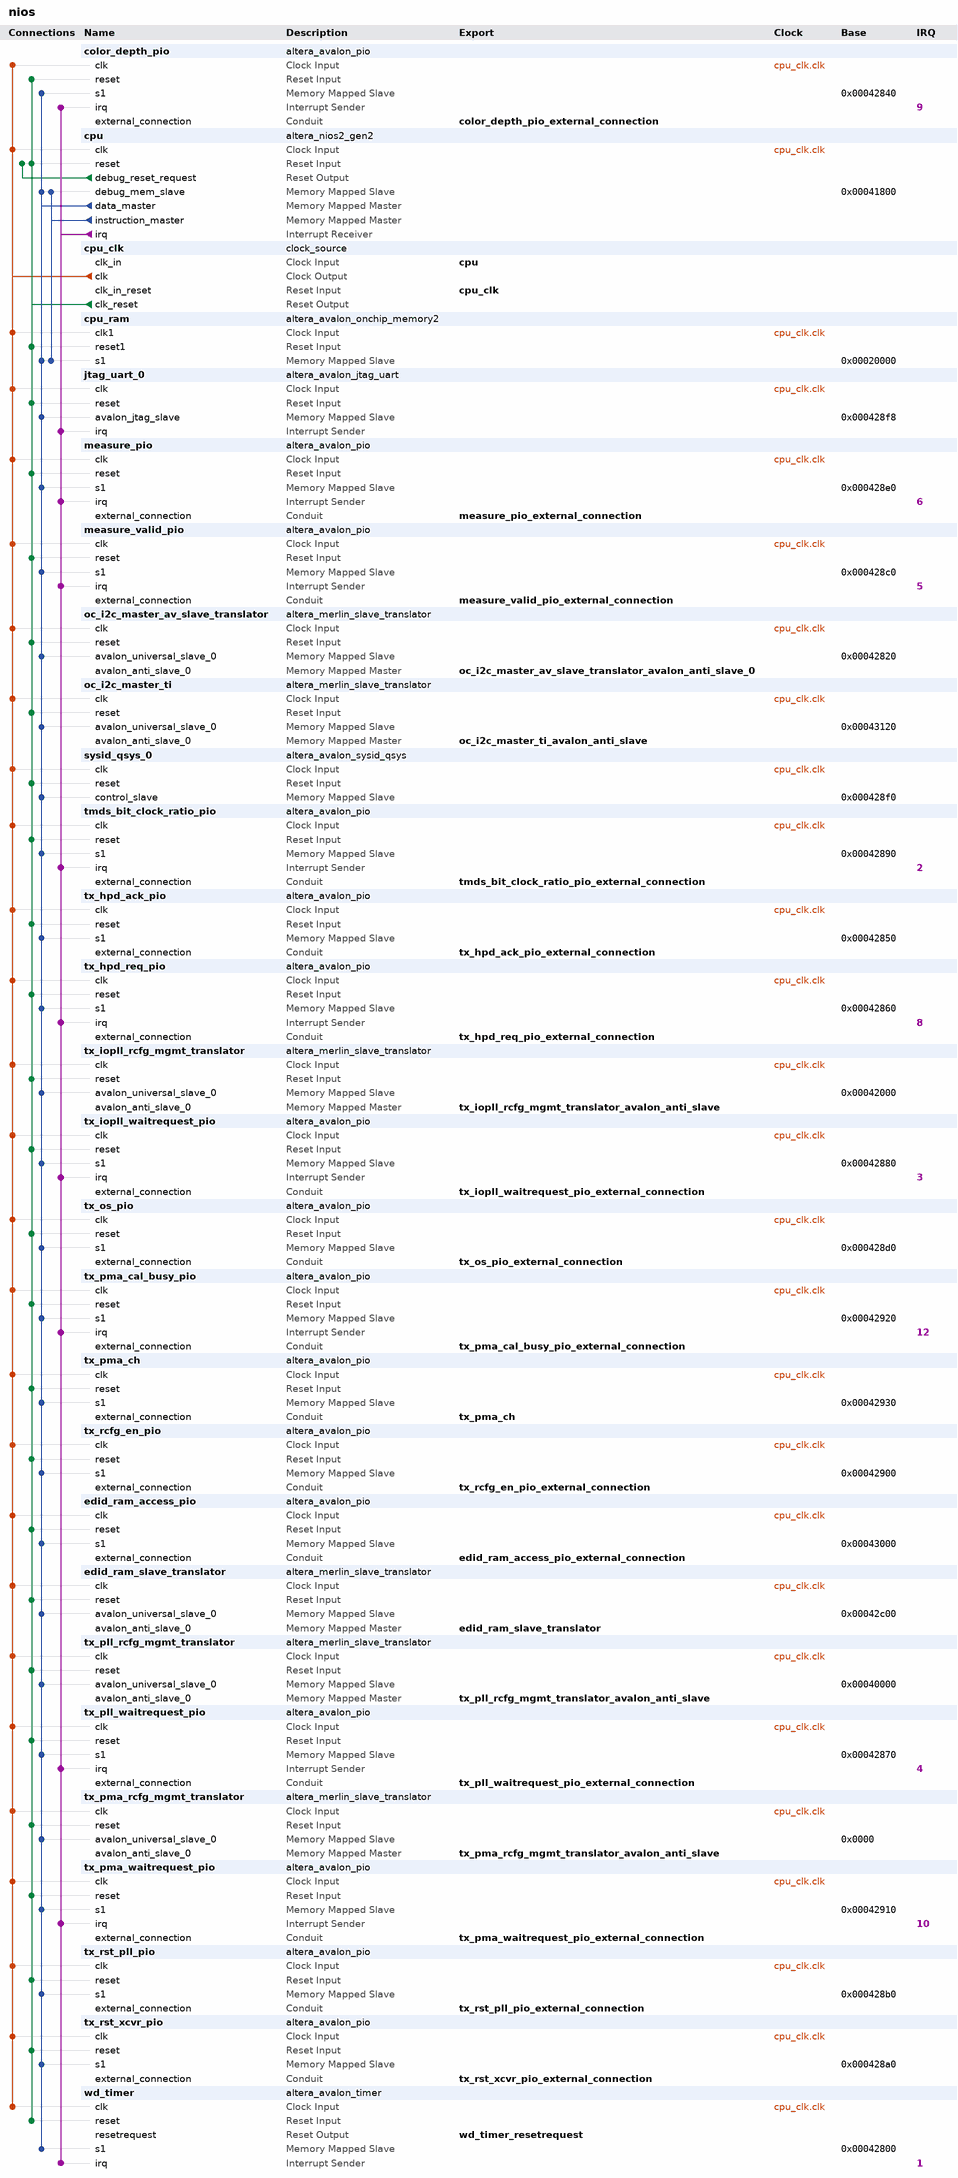
[diagram p0: system contents]
# Platform Designer (Qsys) system nios, Cyclone 10 GX 10CX220YF780E5G
# Parameters at their usual value, and those the tool derives, are not listed.
package require -exact qsys 1.0
create_system nios
set_project_property DEVICE_FAMILY {Cyclone 10 GX}
set_project_property DEVICE 10CX220YF780E5G

add_component color_depth_pio ip/nios/nios_color_depth_pio.ip altera_avalon_pio color_depth_pio 18.1
load_component color_depth_pio
set_component_parameter_value bitClearingEdgeCapReg true
set_component_parameter_value captureEdge true
set_component_parameter_value direction Input
set_component_parameter_value edgeType ANY
set_component_parameter_value generateIRQ true
set_component_parameter_value irqType EDGE
set_component_parameter_value simDoTestBenchWiring true
set_component_parameter_value width 2
save_component

add_component cpu ip/nios/nios_cpu.ip altera_nios2_gen2 cpu 18.1
load_component cpu
set_component_parameter_value setting_activateTrace true
set_component_parameter_value resetSlave cpu_ram.s1
set_component_parameter_value exceptionSlave cpu_ram.s1
set_component_parameter_value mul_32_impl 3
set_component_parameter_value shift_rot_impl 0
set_component_parameter_value impl Tiny
set_component_parameter_value icache_size 4096
set_component_parameter_value dcache_size 2048
save_component

add_component cpu_clk ip/nios/nios_cpu_clk.ip clock_source cpu_clk 
load_component cpu_clk
set_component_parameter_value clockFrequency 100000000
save_component

add_component cpu_ram ip/nios/nios_cpu_ram.ip altera_avalon_onchip_memory2 cpu_ram 18.1
load_component cpu_ram
set_component_parameter_value dataWidth 32
set_component_parameter_value dualPort false
set_component_parameter_value initMemContent true
set_component_parameter_value initializationFileName onchip_mem.hex
set_component_parameter_value memorySize 120000
save_component

add_component jtag_uart_0 ip/nios/nios_jtag_uart_0.ip altera_avalon_jtag_uart jtag_uart_0 18.1
load_component jtag_uart_0
set_component_parameter_value readBufferDepth 1024
set_component_parameter_value readIRQThreshold 1
set_component_parameter_value simInteractiveOptions NO_INTERACTIVE_WINDOWS
set_component_parameter_value writeBufferDepth 1024
set_component_parameter_value writeIRQThreshold 1
save_component

add_component measure_pio ip/nios/nios_measure_pio.ip altera_avalon_pio measure_pio 18.1
load_component measure_pio
set_component_parameter_value bitClearingEdgeCapReg true
set_component_parameter_value captureEdge true
set_component_parameter_value direction Input
set_component_parameter_value edgeType ANY
set_component_parameter_value generateIRQ true
set_component_parameter_value irqType EDGE
set_component_parameter_value simDoTestBenchWiring true
set_component_parameter_value width 24
save_component

add_component measure_valid_pio ip/nios/nios_measure_valid_pio.ip altera_avalon_pio measure_valid_pio 18.1
load_component measure_valid_pio
set_component_parameter_value bitClearingEdgeCapReg true
set_component_parameter_value captureEdge true
set_component_parameter_value direction Input
set_component_parameter_value edgeType ANY
set_component_parameter_value generateIRQ true
set_component_parameter_value irqType EDGE
set_component_parameter_value simDoTestBenchWiring true
set_component_parameter_value width 1
save_component

add_component oc_i2c_master_av_slave_translator ip/nios/nios_oc_i2c_master_av_slave_translator.ip altera_merlin_slave_translator oc_i2c_master_av_slave_translator 18.1
load_component oc_i2c_master_av_slave_translator
set_component_parameter_value AV_ADDRESS_W 3
set_component_parameter_value AV_DATA_W 32
set_component_parameter_value UAV_DATA_W 32
set_component_parameter_value AV_BURSTCOUNT_W 1
set_component_parameter_value AV_BYTEENABLE_W 4
set_component_parameter_value UAV_BYTEENABLE_W 4
set_component_parameter_value UAV_ADDRESS_W 5
set_component_parameter_value UAV_BURSTCOUNT_W 3
set_component_parameter_value AV_READLATENCY 0
set_component_parameter_value AV_SETUP_WAIT 0
set_component_parameter_value AV_WRITE_WAIT 0
set_component_parameter_value AV_READ_WAIT 1
set_component_parameter_value AV_DATA_HOLD 0
set_component_parameter_value AV_TIMING_UNITS 1
set_component_parameter_value USE_READDATA 1
set_component_parameter_value USE_WRITEDATA 1
set_component_parameter_value USE_READ 0
set_component_parameter_value USE_WRITE 1
set_component_parameter_value USE_BEGINBURSTTRANSFER 0
set_component_parameter_value USE_BEGINTRANSFER 0
set_component_parameter_value USE_BYTEENABLE 0
set_component_parameter_value USE_CHIPSELECT 1
set_component_parameter_value USE_ADDRESS 1
set_component_parameter_value USE_BURSTCOUNT 0
set_component_parameter_value USE_READDATAVALID 0
set_component_parameter_value USE_WAITREQUEST 1
set_component_parameter_value USE_WRITEBYTEENABLE 0
set_component_parameter_value USE_LOCK 0
set_component_parameter_value USE_AV_CLKEN 0
set_component_parameter_value USE_UAV_CLKEN 0
set_component_parameter_value USE_OUTPUTENABLE 0
set_component_parameter_value USE_DEBUGACCESS 0
set_component_parameter_value USE_READRESPONSE 0
set_component_parameter_value USE_WRITERESPONSE 0
set_component_parameter_value AV_SYMBOLS_PER_WORD 4
set_component_parameter_value AV_ADDRESS_SYMBOLS 0
set_component_parameter_value AV_BURSTCOUNT_SYMBOLS 0
set_component_parameter_value AV_CONSTANT_BURST_BEHAVIOR 0
set_component_parameter_value UAV_CONSTANT_BURST_BEHAVIOR 0
set_component_parameter_value AV_REQUIRE_UNALIGNED_ADDRESSES 0
set_component_parameter_value AV_LINEWRAPBURSTS 0
set_component_parameter_value AV_MAX_PENDING_READ_TRANSACTIONS 64
set_component_parameter_value AV_MAX_PENDING_WRITE_TRANSACTIONS 0
set_component_parameter_value AV_BURSTBOUNDARIES 0
set_component_parameter_value AV_INTERLEAVEBURSTS 0
set_component_parameter_value AV_BITS_PER_SYMBOL 8
set_component_parameter_value AV_ISBIGENDIAN 0
set_component_parameter_value AV_ADDRESSGROUP 0
set_component_parameter_value UAV_ADDRESSGROUP 0
set_component_parameter_value AV_REGISTEROUTGOINGSIGNALS 0
set_component_parameter_value AV_REGISTERINCOMINGSIGNALS 0
set_component_parameter_value AV_ALWAYSBURSTMAXBURST 0
set_component_parameter_value CHIPSELECT_THROUGH_READLATENCY 0
set_component_parameter_value CLOCK_RATE 100000000
set_component_parameter_value AV_READ_WAIT_CYCLES 1
set_component_parameter_value AV_WRITE_WAIT_CYCLES 0
set_component_parameter_value AV_SETUP_WAIT_CYCLES 0
set_component_parameter_value AV_DATA_HOLD_CYCLES 0
set_component_parameter_value WAITREQUEST_ALLOWANCE 0
set_component_parameter_value SYNC_RESET 0
save_component

add_component oc_i2c_master_ti ip/nios/nios_oc_i2c_master_ti.ip altera_merlin_slave_translator oc_i2c_master_ti 18.1
load_component oc_i2c_master_ti
set_component_parameter_value AV_ADDRESS_W 3
set_component_parameter_value AV_DATA_W 32
set_component_parameter_value UAV_DATA_W 32
set_component_parameter_value AV_BURSTCOUNT_W 1
set_component_parameter_value AV_BYTEENABLE_W 4
set_component_parameter_value UAV_BYTEENABLE_W 4
set_component_parameter_value UAV_ADDRESS_W 5
set_component_parameter_value UAV_BURSTCOUNT_W 3
set_component_parameter_value AV_READLATENCY 0
set_component_parameter_value AV_SETUP_WAIT 0
set_component_parameter_value AV_WRITE_WAIT 0
set_component_parameter_value AV_READ_WAIT 1
set_component_parameter_value AV_DATA_HOLD 0
set_component_parameter_value AV_TIMING_UNITS 1
set_component_parameter_value USE_READDATA 1
set_component_parameter_value USE_WRITEDATA 1
set_component_parameter_value USE_READ 0
set_component_parameter_value USE_WRITE 1
set_component_parameter_value USE_BEGINBURSTTRANSFER 0
set_component_parameter_value USE_BEGINTRANSFER 0
set_component_parameter_value USE_BYTEENABLE 0
set_component_parameter_value USE_CHIPSELECT 1
set_component_parameter_value USE_ADDRESS 1
set_component_parameter_value USE_BURSTCOUNT 0
set_component_parameter_value USE_READDATAVALID 0
set_component_parameter_value USE_WAITREQUEST 1
set_component_parameter_value USE_WRITEBYTEENABLE 0
set_component_parameter_value USE_LOCK 0
set_component_parameter_value USE_AV_CLKEN 0
set_component_parameter_value USE_UAV_CLKEN 0
set_component_parameter_value USE_OUTPUTENABLE 0
set_component_parameter_value USE_DEBUGACCESS 0
set_component_parameter_value USE_READRESPONSE 0
set_component_parameter_value USE_WRITERESPONSE 0
set_component_parameter_value AV_SYMBOLS_PER_WORD 4
set_component_parameter_value AV_ADDRESS_SYMBOLS 0
set_component_parameter_value AV_BURSTCOUNT_SYMBOLS 0
set_component_parameter_value AV_CONSTANT_BURST_BEHAVIOR 0
set_component_parameter_value UAV_CONSTANT_BURST_BEHAVIOR 0
set_component_parameter_value AV_REQUIRE_UNALIGNED_ADDRESSES 0
set_component_parameter_value AV_LINEWRAPBURSTS 0
set_component_parameter_value AV_MAX_PENDING_READ_TRANSACTIONS 64
set_component_parameter_value AV_MAX_PENDING_WRITE_TRANSACTIONS 0
set_component_parameter_value AV_BURSTBOUNDARIES 0
set_component_parameter_value AV_INTERLEAVEBURSTS 0
set_component_parameter_value AV_BITS_PER_SYMBOL 8
set_component_parameter_value AV_ISBIGENDIAN 0
set_component_parameter_value AV_ADDRESSGROUP 0
set_component_parameter_value UAV_ADDRESSGROUP 0
set_component_parameter_value AV_REGISTEROUTGOINGSIGNALS 0
set_component_parameter_value AV_REGISTERINCOMINGSIGNALS 0
set_component_parameter_value AV_ALWAYSBURSTMAXBURST 0
set_component_parameter_value CHIPSELECT_THROUGH_READLATENCY 0
set_component_parameter_value CLOCK_RATE 100000000
set_component_parameter_value AV_READ_WAIT_CYCLES 1
set_component_parameter_value AV_WRITE_WAIT_CYCLES 0
set_component_parameter_value AV_SETUP_WAIT_CYCLES 0
set_component_parameter_value AV_DATA_HOLD_CYCLES 0
set_component_parameter_value WAITREQUEST_ALLOWANCE 0
set_component_parameter_value SYNC_RESET 0
save_component

add_component sysid_qsys_0 ip/nios/nios_sysid_qsys_0.ip altera_avalon_sysid_qsys sysid_qsys_0 18.1
load_component sysid_qsys_0
set_component_parameter_value id 0
set_component_parameter_value ID_VALUE 0
set_component_parameter_value TIMESTAMP 0
save_component

add_component tmds_bit_clock_ratio_pio ip/nios/nios_tmds_bit_clock_ratio_pio.ip altera_avalon_pio tmds_bit_clock_ratio_pio 18.1
load_component tmds_bit_clock_ratio_pio
set_component_parameter_value bitClearingEdgeCapReg true
set_component_parameter_value captureEdge true
set_component_parameter_value direction Input
set_component_parameter_value edgeType ANY
set_component_parameter_value generateIRQ true
set_component_parameter_value irqType EDGE
set_component_parameter_value width 1
save_component

add_component tx_hpd_ack_pio ip/nios/nios_tx_hpd_ack_pio.ip altera_avalon_pio tx_hpd_ack_pio 18.1
load_component tx_hpd_ack_pio
set_component_parameter_value direction Output
set_component_parameter_value width 1
save_component

add_component tx_hpd_req_pio ip/nios/nios_tx_hpd_req_pio.ip altera_avalon_pio tx_hpd_req_pio 18.1
load_component tx_hpd_req_pio
set_component_parameter_value bitClearingEdgeCapReg true
set_component_parameter_value captureEdge true
set_component_parameter_value direction Input
set_component_parameter_value edgeType ANY
set_component_parameter_value generateIRQ true
set_component_parameter_value irqType EDGE
set_component_parameter_value simDoTestBenchWiring true
set_component_parameter_value width 1
save_component

add_component tx_iopll_rcfg_mgmt_translator ip/nios/nios_tx_iopll_rcfg_mgmt_translator.ip altera_merlin_slave_translator tx_iopll_rcfg_mgmt_translator 18.1
load_component tx_iopll_rcfg_mgmt_translator
set_component_parameter_value AV_ADDRESS_W 9
set_component_parameter_value AV_DATA_W 32
set_component_parameter_value UAV_DATA_W 32
set_component_parameter_value AV_BURSTCOUNT_W 1
set_component_parameter_value AV_BYTEENABLE_W 4
set_component_parameter_value UAV_BYTEENABLE_W 4
set_component_parameter_value UAV_ADDRESS_W 12
set_component_parameter_value UAV_BURSTCOUNT_W 3
set_component_parameter_value AV_READLATENCY 0
set_component_parameter_value AV_SETUP_WAIT 0
set_component_parameter_value AV_WRITE_WAIT 0
set_component_parameter_value AV_READ_WAIT 1
set_component_parameter_value AV_DATA_HOLD 0
set_component_parameter_value AV_TIMING_UNITS 1
set_component_parameter_value USE_READDATA 1
set_component_parameter_value USE_WRITEDATA 1
set_component_parameter_value USE_READ 1
set_component_parameter_value USE_WRITE 1
set_component_parameter_value USE_BEGINBURSTTRANSFER 0
set_component_parameter_value USE_BEGINTRANSFER 0
set_component_parameter_value USE_BYTEENABLE 0
set_component_parameter_value USE_CHIPSELECT 0
set_component_parameter_value USE_ADDRESS 1
set_component_parameter_value USE_BURSTCOUNT 0
set_component_parameter_value USE_READDATAVALID 0
set_component_parameter_value USE_WAITREQUEST 0
set_component_parameter_value USE_WRITEBYTEENABLE 0
set_component_parameter_value USE_LOCK 0
set_component_parameter_value USE_AV_CLKEN 0
set_component_parameter_value USE_UAV_CLKEN 0
set_component_parameter_value USE_OUTPUTENABLE 0
set_component_parameter_value USE_DEBUGACCESS 0
set_component_parameter_value USE_READRESPONSE 0
set_component_parameter_value USE_WRITERESPONSE 0
set_component_parameter_value AV_SYMBOLS_PER_WORD 4
set_component_parameter_value AV_ADDRESS_SYMBOLS 0
set_component_parameter_value AV_BURSTCOUNT_SYMBOLS 0
set_component_parameter_value AV_CONSTANT_BURST_BEHAVIOR 0
set_component_parameter_value UAV_CONSTANT_BURST_BEHAVIOR 0
set_component_parameter_value AV_REQUIRE_UNALIGNED_ADDRESSES 0
set_component_parameter_value AV_LINEWRAPBURSTS 0
set_component_parameter_value AV_MAX_PENDING_READ_TRANSACTIONS 64
set_component_parameter_value AV_MAX_PENDING_WRITE_TRANSACTIONS 0
set_component_parameter_value AV_BURSTBOUNDARIES 0
set_component_parameter_value AV_INTERLEAVEBURSTS 0
set_component_parameter_value AV_BITS_PER_SYMBOL 8
set_component_parameter_value AV_ISBIGENDIAN 0
set_component_parameter_value AV_ADDRESSGROUP 0
set_component_parameter_value UAV_ADDRESSGROUP 0
set_component_parameter_value AV_REGISTEROUTGOINGSIGNALS 0
set_component_parameter_value AV_REGISTERINCOMINGSIGNALS 0
set_component_parameter_value AV_ALWAYSBURSTMAXBURST 0
set_component_parameter_value CHIPSELECT_THROUGH_READLATENCY 0
set_component_parameter_value CLOCK_RATE 100000000
set_component_parameter_value AV_READ_WAIT_CYCLES 1
set_component_parameter_value AV_WRITE_WAIT_CYCLES 0
set_component_parameter_value AV_SETUP_WAIT_CYCLES 0
set_component_parameter_value AV_DATA_HOLD_CYCLES 0
set_component_parameter_value WAITREQUEST_ALLOWANCE 0
set_component_parameter_value SYNC_RESET 0
save_component

add_component tx_iopll_waitrequest_pio ip/nios/nios_tx_iopll_waitrequest_pio.ip altera_avalon_pio tx_iopll_waitrequest_pio 18.1
load_component tx_iopll_waitrequest_pio
set_component_parameter_value bitClearingEdgeCapReg true
set_component_parameter_value captureEdge true
set_component_parameter_value direction Input
set_component_parameter_value edgeType ANY
set_component_parameter_value generateIRQ true
set_component_parameter_value irqType EDGE
set_component_parameter_value simDoTestBenchWiring true
set_component_parameter_value width 1
save_component

add_component tx_os_pio ip/nios/nios_tx_os_pio.ip altera_avalon_pio tx_os_pio 18.1
load_component tx_os_pio
set_component_parameter_value direction Output
set_component_parameter_value width 2
save_component

add_component tx_pma_cal_busy_pio ip/nios/nios_tx_pma_cal_busy_pio.ip altera_avalon_pio tx_pma_cal_busy_pio 18.1
load_component tx_pma_cal_busy_pio
set_component_parameter_value bitClearingEdgeCapReg true
set_component_parameter_value captureEdge true
set_component_parameter_value direction Input
set_component_parameter_value edgeType ANY
set_component_parameter_value generateIRQ true
set_component_parameter_value irqType EDGE
set_component_parameter_value simDoTestBenchWiring true
set_component_parameter_value width 1
save_component

add_component tx_pma_ch ip/nios/nios_tx_pma_ch.ip altera_avalon_pio tx_pma_ch 18.1
load_component tx_pma_ch
set_component_parameter_value direction Output
set_component_parameter_value width 2
save_component

add_component tx_rcfg_en_pio ip/nios/nios_tx_rcfg_en_pio.ip altera_avalon_pio tx_rcfg_en_pio 18.1
load_component tx_rcfg_en_pio
set_component_parameter_value direction Output
set_component_parameter_value width 1
save_component

add_component edid_ram_access_pio ip/nios/nios_edid_ram_access_pio.ip altera_avalon_pio edid_ram_access_pio 18.1
load_component edid_ram_access_pio
set_component_parameter_value direction Output
set_component_parameter_value width 1
save_component

add_component edid_ram_slave_translator ip/nios/nios_edid_ram_slave_translator.ip altera_merlin_slave_translator edid_ram_slave_translator 18.1
load_component edid_ram_slave_translator
set_component_parameter_value AV_ADDRESS_W 8
set_component_parameter_value AV_DATA_W 8
set_component_parameter_value UAV_DATA_W 8
set_component_parameter_value AV_BURSTCOUNT_W 1
set_component_parameter_value AV_BYTEENABLE_W 1
set_component_parameter_value UAV_BYTEENABLE_W 1
set_component_parameter_value UAV_ADDRESS_W 11
set_component_parameter_value UAV_BURSTCOUNT_W 3
set_component_parameter_value AV_READLATENCY 0
set_component_parameter_value AV_SETUP_WAIT 0
set_component_parameter_value AV_WRITE_WAIT 1
set_component_parameter_value AV_READ_WAIT 0
set_component_parameter_value AV_DATA_HOLD 0
set_component_parameter_value AV_TIMING_UNITS 1
set_component_parameter_value USE_READDATA 1
set_component_parameter_value USE_WRITEDATA 1
set_component_parameter_value USE_READ 1
set_component_parameter_value USE_WRITE 1
set_component_parameter_value USE_BEGINBURSTTRANSFER 0
set_component_parameter_value USE_BEGINTRANSFER 0
set_component_parameter_value USE_BYTEENABLE 0
set_component_parameter_value USE_CHIPSELECT 0
set_component_parameter_value USE_ADDRESS 1
set_component_parameter_value USE_BURSTCOUNT 0
set_component_parameter_value USE_READDATAVALID 0
set_component_parameter_value USE_WAITREQUEST 1
set_component_parameter_value USE_WRITEBYTEENABLE 0
set_component_parameter_value USE_LOCK 0
set_component_parameter_value USE_AV_CLKEN 0
set_component_parameter_value USE_UAV_CLKEN 0
set_component_parameter_value USE_OUTPUTENABLE 0
set_component_parameter_value USE_DEBUGACCESS 0
set_component_parameter_value USE_READRESPONSE 0
set_component_parameter_value USE_WRITERESPONSE 0
set_component_parameter_value AV_SYMBOLS_PER_WORD 4
set_component_parameter_value AV_ADDRESS_SYMBOLS 0
set_component_parameter_value AV_BURSTCOUNT_SYMBOLS 0
set_component_parameter_value AV_CONSTANT_BURST_BEHAVIOR 0
set_component_parameter_value UAV_CONSTANT_BURST_BEHAVIOR 0
set_component_parameter_value AV_REQUIRE_UNALIGNED_ADDRESSES 0
set_component_parameter_value AV_LINEWRAPBURSTS 0
set_component_parameter_value AV_MAX_PENDING_READ_TRANSACTIONS 64
set_component_parameter_value AV_MAX_PENDING_WRITE_TRANSACTIONS 0
set_component_parameter_value AV_BURSTBOUNDARIES 0
set_component_parameter_value AV_INTERLEAVEBURSTS 0
set_component_parameter_value AV_BITS_PER_SYMBOL 8
set_component_parameter_value AV_ISBIGENDIAN 0
set_component_parameter_value AV_ADDRESSGROUP 0
set_component_parameter_value UAV_ADDRESSGROUP 0
set_component_parameter_value AV_REGISTEROUTGOINGSIGNALS 0
set_component_parameter_value AV_REGISTERINCOMINGSIGNALS 0
set_component_parameter_value AV_ALWAYSBURSTMAXBURST 0
set_component_parameter_value CHIPSELECT_THROUGH_READLATENCY 0
set_component_parameter_value CLOCK_RATE 100000000
set_component_parameter_value AV_READ_WAIT_CYCLES 0
set_component_parameter_value AV_WRITE_WAIT_CYCLES 1
set_component_parameter_value AV_SETUP_WAIT_CYCLES 0
set_component_parameter_value AV_DATA_HOLD_CYCLES 0
set_component_parameter_value WAITREQUEST_ALLOWANCE 0
set_component_parameter_value SYNC_RESET 0
save_component

add_component tx_pll_rcfg_mgmt_translator ip/nios/nios_tx_pll_rcfg_mgmt_translator.ip altera_merlin_slave_translator tx_pll_rcfg_mgmt_translator 18.1
load_component tx_pll_rcfg_mgmt_translator
set_component_parameter_value AV_ADDRESS_W 10
set_component_parameter_value AV_DATA_W 32
set_component_parameter_value UAV_DATA_W 32
set_component_parameter_value AV_BURSTCOUNT_W 1
set_component_parameter_value AV_BYTEENABLE_W 4
set_component_parameter_value UAV_BYTEENABLE_W 4
set_component_parameter_value UAV_ADDRESS_W 12
set_component_parameter_value UAV_BURSTCOUNT_W 3
set_component_parameter_value AV_READLATENCY 0
set_component_parameter_value AV_SETUP_WAIT 0
set_component_parameter_value AV_WRITE_WAIT 0
set_component_parameter_value AV_READ_WAIT 1
set_component_parameter_value AV_DATA_HOLD 0
set_component_parameter_value AV_TIMING_UNITS 1
set_component_parameter_value USE_READDATA 1
set_component_parameter_value USE_WRITEDATA 1
set_component_parameter_value USE_READ 1
set_component_parameter_value USE_WRITE 1
set_component_parameter_value USE_BEGINBURSTTRANSFER 0
set_component_parameter_value USE_BEGINTRANSFER 0
set_component_parameter_value USE_BYTEENABLE 0
set_component_parameter_value USE_CHIPSELECT 0
set_component_parameter_value USE_ADDRESS 1
set_component_parameter_value USE_BURSTCOUNT 0
set_component_parameter_value USE_READDATAVALID 0
set_component_parameter_value USE_WAITREQUEST 1
set_component_parameter_value USE_WRITEBYTEENABLE 0
set_component_parameter_value USE_LOCK 0
set_component_parameter_value USE_AV_CLKEN 0
set_component_parameter_value USE_UAV_CLKEN 0
set_component_parameter_value USE_OUTPUTENABLE 0
set_component_parameter_value USE_DEBUGACCESS 0
set_component_parameter_value USE_READRESPONSE 0
set_component_parameter_value USE_WRITERESPONSE 0
set_component_parameter_value AV_SYMBOLS_PER_WORD 4
set_component_parameter_value AV_ADDRESS_SYMBOLS 0
set_component_parameter_value AV_BURSTCOUNT_SYMBOLS 0
set_component_parameter_value AV_CONSTANT_BURST_BEHAVIOR 0
set_component_parameter_value UAV_CONSTANT_BURST_BEHAVIOR 0
set_component_parameter_value AV_REQUIRE_UNALIGNED_ADDRESSES 0
set_component_parameter_value AV_LINEWRAPBURSTS 0
set_component_parameter_value AV_MAX_PENDING_READ_TRANSACTIONS 64
set_component_parameter_value AV_MAX_PENDING_WRITE_TRANSACTIONS 0
set_component_parameter_value AV_BURSTBOUNDARIES 0
set_component_parameter_value AV_INTERLEAVEBURSTS 0
set_component_parameter_value AV_BITS_PER_SYMBOL 8
set_component_parameter_value AV_ISBIGENDIAN 0
set_component_parameter_value AV_ADDRESSGROUP 0
set_component_parameter_value UAV_ADDRESSGROUP 0
set_component_parameter_value AV_REGISTEROUTGOINGSIGNALS 0
set_component_parameter_value AV_REGISTERINCOMINGSIGNALS 0
set_component_parameter_value AV_ALWAYSBURSTMAXBURST 0
set_component_parameter_value CHIPSELECT_THROUGH_READLATENCY 0
set_component_parameter_value CLOCK_RATE 100000000
set_component_parameter_value AV_READ_WAIT_CYCLES 1
set_component_parameter_value AV_WRITE_WAIT_CYCLES 0
set_component_parameter_value AV_SETUP_WAIT_CYCLES 0
set_component_parameter_value AV_DATA_HOLD_CYCLES 0
set_component_parameter_value WAITREQUEST_ALLOWANCE 0
set_component_parameter_value SYNC_RESET 0
save_component

add_component tx_pll_waitrequest_pio ip/nios/nios_tx_pll_waitrequest_pio.ip altera_avalon_pio tx_pll_waitrequest_pio 18.1
load_component tx_pll_waitrequest_pio
set_component_parameter_value bitClearingEdgeCapReg true
set_component_parameter_value captureEdge true
set_component_parameter_value direction Input
set_component_parameter_value edgeType ANY
set_component_parameter_value generateIRQ true
set_component_parameter_value irqType EDGE
set_component_parameter_value simDoTestBenchWiring true
set_component_parameter_value width 1
save_component

add_component tx_pma_rcfg_mgmt_translator ip/nios/nios_tx_pma_rcfg_mgmt_translator.ip altera_merlin_slave_translator tx_pma_rcfg_mgmt_translator 18.1
load_component tx_pma_rcfg_mgmt_translator
set_component_parameter_value AV_ADDRESS_W 12
set_component_parameter_value AV_DATA_W 32
set_component_parameter_value UAV_DATA_W 32
set_component_parameter_value AV_BURSTCOUNT_W 1
set_component_parameter_value AV_BYTEENABLE_W 4
set_component_parameter_value UAV_BYTEENABLE_W 4
set_component_parameter_value UAV_ADDRESS_W 14
set_component_parameter_value UAV_BURSTCOUNT_W 3
set_component_parameter_value AV_READLATENCY 0
set_component_parameter_value AV_SETUP_WAIT 0
set_component_parameter_value AV_WRITE_WAIT 0
set_component_parameter_value AV_READ_WAIT 1
set_component_parameter_value AV_DATA_HOLD 0
set_component_parameter_value AV_TIMING_UNITS 1
set_component_parameter_value USE_READDATA 1
set_component_parameter_value USE_WRITEDATA 1
set_component_parameter_value USE_READ 1
set_component_parameter_value USE_WRITE 1
set_component_parameter_value USE_BEGINBURSTTRANSFER 0
set_component_parameter_value USE_BEGINTRANSFER 0
set_component_parameter_value USE_BYTEENABLE 0
set_component_parameter_value USE_CHIPSELECT 0
set_component_parameter_value USE_ADDRESS 1
set_component_parameter_value USE_BURSTCOUNT 0
set_component_parameter_value USE_READDATAVALID 0
set_component_parameter_value USE_WAITREQUEST 1
set_component_parameter_value USE_WRITEBYTEENABLE 0
set_component_parameter_value USE_LOCK 0
set_component_parameter_value USE_AV_CLKEN 0
set_component_parameter_value USE_UAV_CLKEN 0
set_component_parameter_value USE_OUTPUTENABLE 0
set_component_parameter_value USE_DEBUGACCESS 0
set_component_parameter_value USE_READRESPONSE 0
set_component_parameter_value USE_WRITERESPONSE 0
set_component_parameter_value AV_SYMBOLS_PER_WORD 4
set_component_parameter_value AV_ADDRESS_SYMBOLS 0
set_component_parameter_value AV_BURSTCOUNT_SYMBOLS 0
set_component_parameter_value AV_CONSTANT_BURST_BEHAVIOR 0
set_component_parameter_value UAV_CONSTANT_BURST_BEHAVIOR 0
set_component_parameter_value AV_REQUIRE_UNALIGNED_ADDRESSES 0
set_component_parameter_value AV_LINEWRAPBURSTS 0
set_component_parameter_value AV_MAX_PENDING_READ_TRANSACTIONS 64
set_component_parameter_value AV_MAX_PENDING_WRITE_TRANSACTIONS 0
set_component_parameter_value AV_BURSTBOUNDARIES 0
set_component_parameter_value AV_INTERLEAVEBURSTS 0
set_component_parameter_value AV_BITS_PER_SYMBOL 8
set_component_parameter_value AV_ISBIGENDIAN 0
set_component_parameter_value AV_ADDRESSGROUP 0
set_component_parameter_value UAV_ADDRESSGROUP 0
set_component_parameter_value AV_REGISTEROUTGOINGSIGNALS 0
set_component_parameter_value AV_REGISTERINCOMINGSIGNALS 0
set_component_parameter_value AV_ALWAYSBURSTMAXBURST 0
set_component_parameter_value CHIPSELECT_THROUGH_READLATENCY 0
set_component_parameter_value CLOCK_RATE 100000000
set_component_parameter_value AV_READ_WAIT_CYCLES 1
set_component_parameter_value AV_WRITE_WAIT_CYCLES 0
set_component_parameter_value AV_SETUP_WAIT_CYCLES 0
set_component_parameter_value AV_DATA_HOLD_CYCLES 0
set_component_parameter_value WAITREQUEST_ALLOWANCE 0
set_component_parameter_value SYNC_RESET 0
save_component

add_component tx_pma_waitrequest_pio ip/nios/nios_tx_pma_waitrequest_pio.ip altera_avalon_pio tx_pma_waitrequest_pio 18.1
load_component tx_pma_waitrequest_pio
set_component_parameter_value bitClearingEdgeCapReg true
set_component_parameter_value captureEdge true
set_component_parameter_value direction Input
set_component_parameter_value edgeType ANY
set_component_parameter_value generateIRQ true
set_component_parameter_value irqType EDGE
set_component_parameter_value simDoTestBenchWiring true
set_component_parameter_value width 1
save_component

add_component tx_rst_pll_pio ip/nios/nios_tx_rst_pll_pio.ip altera_avalon_pio tx_rst_pll_pio 18.1
load_component tx_rst_pll_pio
set_component_parameter_value direction Output
set_component_parameter_value width 1
save_component

add_component tx_rst_xcvr_pio ip/nios/nios_tx_rst_xcvr_pio.ip altera_avalon_pio tx_rst_xcvr_pio 18.1
load_component tx_rst_xcvr_pio
set_component_parameter_value direction Output
set_component_parameter_value width 1
save_component

add_component wd_timer ip/nios/nios_wd_timer.ip altera_avalon_timer wd_timer 18.1
load_component wd_timer
set_component_parameter_value fixedPeriod true
set_component_parameter_value period 600
set_component_parameter_value periodUnits MSEC
set_component_parameter_value resetOutput true
set_component_parameter_value snapshot false
set_component_parameter_value timerPreset CUSTOM
save_component

# connections
add_connection cpu_clk.clk color_depth_pio.clk clock
add_connection cpu_clk.clk cpu.clk clock
add_connection cpu_clk.clk cpu_ram.clk1 clock
add_connection cpu_clk.clk edid_ram_access_pio.clk clock
add_connection cpu_clk.clk edid_ram_slave_translator.clk clock
add_connection cpu_clk.clk jtag_uart_0.clk clock
add_connection cpu_clk.clk measure_pio.clk clock
add_connection cpu_clk.clk measure_valid_pio.clk clock
add_connection cpu_clk.clk oc_i2c_master_av_slave_translator.clk clock
add_connection cpu_clk.clk oc_i2c_master_ti.clk clock
add_connection cpu_clk.clk sysid_qsys_0.clk clock
add_connection cpu_clk.clk tmds_bit_clock_ratio_pio.clk clock
add_connection cpu_clk.clk tx_hpd_ack_pio.clk clock
add_connection cpu_clk.clk tx_hpd_req_pio.clk clock
add_connection cpu_clk.clk tx_iopll_rcfg_mgmt_translator.clk clock
add_connection cpu_clk.clk tx_iopll_waitrequest_pio.clk clock
add_connection cpu_clk.clk tx_os_pio.clk clock
add_connection cpu_clk.clk tx_pll_rcfg_mgmt_translator.clk clock
add_connection cpu_clk.clk tx_pll_waitrequest_pio.clk clock
add_connection cpu_clk.clk tx_pma_cal_busy_pio.clk clock
add_connection cpu_clk.clk tx_pma_ch.clk clock
add_connection cpu_clk.clk tx_pma_rcfg_mgmt_translator.clk clock
add_connection cpu_clk.clk tx_pma_waitrequest_pio.clk clock
add_connection cpu_clk.clk tx_rcfg_en_pio.clk clock
add_connection cpu_clk.clk tx_rst_pll_pio.clk clock
add_connection cpu_clk.clk tx_rst_xcvr_pio.clk clock
add_connection cpu_clk.clk wd_timer.clk clock
add_connection cpu.debug_reset_request cpu.reset reset
add_connection cpu_clk.clk_reset color_depth_pio.reset reset
add_connection cpu_clk.clk_reset cpu.reset reset
add_connection cpu_clk.clk_reset cpu_ram.reset1 reset
add_connection cpu_clk.clk_reset edid_ram_access_pio.reset reset
add_connection cpu_clk.clk_reset edid_ram_slave_translator.reset reset
add_connection cpu_clk.clk_reset jtag_uart_0.reset reset
add_connection cpu_clk.clk_reset measure_pio.reset reset
add_connection cpu_clk.clk_reset measure_valid_pio.reset reset
add_connection cpu_clk.clk_reset oc_i2c_master_av_slave_translator.reset reset
add_connection cpu_clk.clk_reset oc_i2c_master_ti.reset reset
add_connection cpu_clk.clk_reset sysid_qsys_0.reset reset
add_connection cpu_clk.clk_reset tmds_bit_clock_ratio_pio.reset reset
add_connection cpu_clk.clk_reset tx_hpd_ack_pio.reset reset
add_connection cpu_clk.clk_reset tx_hpd_req_pio.reset reset
add_connection cpu_clk.clk_reset tx_iopll_rcfg_mgmt_translator.reset reset
add_connection cpu_clk.clk_reset tx_iopll_waitrequest_pio.reset reset
add_connection cpu_clk.clk_reset tx_os_pio.reset reset
add_connection cpu_clk.clk_reset tx_pll_rcfg_mgmt_translator.reset reset
add_connection cpu_clk.clk_reset tx_pll_waitrequest_pio.reset reset
add_connection cpu_clk.clk_reset tx_pma_cal_busy_pio.reset reset
add_connection cpu_clk.clk_reset tx_pma_ch.reset reset
add_connection cpu_clk.clk_reset tx_pma_rcfg_mgmt_translator.reset reset
add_connection cpu_clk.clk_reset tx_pma_waitrequest_pio.reset reset
add_connection cpu_clk.clk_reset tx_rcfg_en_pio.reset reset
add_connection cpu_clk.clk_reset tx_rst_pll_pio.reset reset
add_connection cpu_clk.clk_reset tx_rst_xcvr_pio.reset reset
add_connection cpu_clk.clk_reset wd_timer.reset reset
add_connection cpu.data_master color_depth_pio.s1 avalon
set_connection_parameter_value cpu.data_master/color_depth_pio.s1 baseAddress 0x00042840
add_connection cpu.data_master cpu.debug_mem_slave avalon
set_connection_parameter_value cpu.data_master/cpu.debug_mem_slave baseAddress 0x00041800
add_connection cpu.data_master cpu_ram.s1 avalon
set_connection_parameter_value cpu.data_master/cpu_ram.s1 baseAddress 0x00020000
add_connection cpu.data_master edid_ram_access_pio.s1 avalon
set_connection_parameter_value cpu.data_master/edid_ram_access_pio.s1 baseAddress 0x00043000
add_connection cpu.data_master edid_ram_slave_translator.avalon_universal_slave_0 avalon
set_connection_parameter_value cpu.data_master/edid_ram_slave_translator.avalon_universal_slave_0 baseAddress 0x00042c00
add_connection cpu.data_master jtag_uart_0.avalon_jtag_slave avalon
set_connection_parameter_value cpu.data_master/jtag_uart_0.avalon_jtag_slave baseAddress 0x000428f8
add_connection cpu.data_master measure_pio.s1 avalon
set_connection_parameter_value cpu.data_master/measure_pio.s1 baseAddress 0x000428e0
add_connection cpu.data_master measure_valid_pio.s1 avalon
set_connection_parameter_value cpu.data_master/measure_valid_pio.s1 baseAddress 0x000428c0
add_connection cpu.data_master oc_i2c_master_av_slave_translator.avalon_universal_slave_0 avalon
set_connection_parameter_value cpu.data_master/oc_i2c_master_av_slave_translator.avalon_universal_slave_0 baseAddress 0x00042820
add_connection cpu.data_master oc_i2c_master_ti.avalon_universal_slave_0 avalon
set_connection_parameter_value cpu.data_master/oc_i2c_master_ti.avalon_universal_slave_0 baseAddress 0x00043120
add_connection cpu.data_master sysid_qsys_0.control_slave avalon
set_connection_parameter_value cpu.data_master/sysid_qsys_0.control_slave baseAddress 0x000428f0
add_connection cpu.data_master tmds_bit_clock_ratio_pio.s1 avalon
set_connection_parameter_value cpu.data_master/tmds_bit_clock_ratio_pio.s1 baseAddress 0x00042890
add_connection cpu.data_master tx_hpd_ack_pio.s1 avalon
set_connection_parameter_value cpu.data_master/tx_hpd_ack_pio.s1 baseAddress 0x00042850
add_connection cpu.data_master tx_hpd_req_pio.s1 avalon
set_connection_parameter_value cpu.data_master/tx_hpd_req_pio.s1 baseAddress 0x00042860
add_connection cpu.data_master tx_iopll_rcfg_mgmt_translator.avalon_universal_slave_0 avalon
set_connection_parameter_value cpu.data_master/tx_iopll_rcfg_mgmt_translator.avalon_universal_slave_0 baseAddress 0x00042000
add_connection cpu.data_master tx_iopll_waitrequest_pio.s1 avalon
set_connection_parameter_value cpu.data_master/tx_iopll_waitrequest_pio.s1 baseAddress 0x00042880
add_connection cpu.data_master tx_os_pio.s1 avalon
set_connection_parameter_value cpu.data_master/tx_os_pio.s1 baseAddress 0x000428d0
add_connection cpu.data_master tx_pll_rcfg_mgmt_translator.avalon_universal_slave_0 avalon
set_connection_parameter_value cpu.data_master/tx_pll_rcfg_mgmt_translator.avalon_universal_slave_0 baseAddress 0x00040000
add_connection cpu.data_master tx_pll_waitrequest_pio.s1 avalon
set_connection_parameter_value cpu.data_master/tx_pll_waitrequest_pio.s1 baseAddress 0x00042870
add_connection cpu.data_master tx_pma_cal_busy_pio.s1 avalon
set_connection_parameter_value cpu.data_master/tx_pma_cal_busy_pio.s1 baseAddress 0x00042920
add_connection cpu.data_master tx_pma_ch.s1 avalon
set_connection_parameter_value cpu.data_master/tx_pma_ch.s1 baseAddress 0x00042930
add_connection cpu.data_master tx_pma_rcfg_mgmt_translator.avalon_universal_slave_0 avalon
set_connection_parameter_value cpu.data_master/tx_pma_rcfg_mgmt_translator.avalon_universal_slave_0 baseAddress 0x0000
add_connection cpu.data_master tx_pma_waitrequest_pio.s1 avalon
set_connection_parameter_value cpu.data_master/tx_pma_waitrequest_pio.s1 baseAddress 0x00042910
add_connection cpu.data_master tx_rcfg_en_pio.s1 avalon
set_connection_parameter_value cpu.data_master/tx_rcfg_en_pio.s1 baseAddress 0x00042900
add_connection cpu.data_master tx_rst_pll_pio.s1 avalon
set_connection_parameter_value cpu.data_master/tx_rst_pll_pio.s1 baseAddress 0x000428b0
add_connection cpu.data_master tx_rst_xcvr_pio.s1 avalon
set_connection_parameter_value cpu.data_master/tx_rst_xcvr_pio.s1 baseAddress 0x000428a0
add_connection cpu.data_master wd_timer.s1 avalon
set_connection_parameter_value cpu.data_master/wd_timer.s1 baseAddress 0x00042800
add_connection cpu.instruction_master cpu.debug_mem_slave avalon
set_connection_parameter_value cpu.instruction_master/cpu.debug_mem_slave baseAddress 0x00041800
add_connection cpu.instruction_master cpu_ram.s1 avalon
set_connection_parameter_value cpu.instruction_master/cpu_ram.s1 baseAddress 0x00020000
add_connection cpu.irq color_depth_pio.irq interrupt
set_connection_parameter_value cpu.irq/color_depth_pio.irq irqNumber 9
add_connection cpu.irq jtag_uart_0.irq interrupt
add_connection cpu.irq measure_pio.irq interrupt
set_connection_parameter_value cpu.irq/measure_pio.irq irqNumber 6
add_connection cpu.irq measure_valid_pio.irq interrupt
set_connection_parameter_value cpu.irq/measure_valid_pio.irq irqNumber 5
add_connection cpu.irq tmds_bit_clock_ratio_pio.irq interrupt
set_connection_parameter_value cpu.irq/tmds_bit_clock_ratio_pio.irq irqNumber 2
add_connection cpu.irq tx_hpd_req_pio.irq interrupt
set_connection_parameter_value cpu.irq/tx_hpd_req_pio.irq irqNumber 8
add_connection cpu.irq tx_iopll_waitrequest_pio.irq interrupt
set_connection_parameter_value cpu.irq/tx_iopll_waitrequest_pio.irq irqNumber 3
add_connection cpu.irq tx_pll_waitrequest_pio.irq interrupt
set_connection_parameter_value cpu.irq/tx_pll_waitrequest_pio.irq irqNumber 4
add_connection cpu.irq tx_pma_cal_busy_pio.irq interrupt
set_connection_parameter_value cpu.irq/tx_pma_cal_busy_pio.irq irqNumber 12
add_connection cpu.irq tx_pma_waitrequest_pio.irq interrupt
set_connection_parameter_value cpu.irq/tx_pma_waitrequest_pio.irq irqNumber 10
add_connection cpu.irq wd_timer.irq interrupt
set_connection_parameter_value cpu.irq/wd_timer.irq irqNumber 1

# exported interfaces
add_interface color_depth_pio_external_connection conduit end
set_interface_property color_depth_pio_external_connection EXPORT_OF color_depth_pio.external_connection
add_interface cpu clock sink
set_interface_property cpu EXPORT_OF cpu_clk.clk_in
add_interface cpu_clk reset sink
set_interface_property cpu_clk EXPORT_OF cpu_clk.clk_in_reset
add_interface edid_ram_access_pio_external_connection conduit end
set_interface_property edid_ram_access_pio_external_connection EXPORT_OF edid_ram_access_pio.external_connection
add_interface edid_ram_slave_translator avalon master
set_interface_property edid_ram_slave_translator EXPORT_OF edid_ram_slave_translator.avalon_anti_slave_0
add_interface measure_pio_external_connection conduit end
set_interface_property measure_pio_external_connection EXPORT_OF measure_pio.external_connection
add_interface measure_valid_pio_external_connection conduit end
set_interface_property measure_valid_pio_external_connection EXPORT_OF measure_valid_pio.external_connection
add_interface oc_i2c_master_av_slave_translator_avalon_anti_slave_0 avalon master
set_interface_property oc_i2c_master_av_slave_translator_avalon_anti_slave_0 EXPORT_OF oc_i2c_master_av_slave_translator.avalon_anti_slave_0
add_interface oc_i2c_master_ti_avalon_anti_slave avalon master
set_interface_property oc_i2c_master_ti_avalon_anti_slave EXPORT_OF oc_i2c_master_ti.avalon_anti_slave_0
add_interface tmds_bit_clock_ratio_pio_external_connection conduit end
set_interface_property tmds_bit_clock_ratio_pio_external_connection EXPORT_OF tmds_bit_clock_ratio_pio.external_connection
add_interface tx_hpd_ack_pio_external_connection conduit end
set_interface_property tx_hpd_ack_pio_external_connection EXPORT_OF tx_hpd_ack_pio.external_connection
add_interface tx_hpd_req_pio_external_connection conduit end
set_interface_property tx_hpd_req_pio_external_connection EXPORT_OF tx_hpd_req_pio.external_connection
add_interface tx_iopll_rcfg_mgmt_translator_avalon_anti_slave avalon master
set_interface_property tx_iopll_rcfg_mgmt_translator_avalon_anti_slave EXPORT_OF tx_iopll_rcfg_mgmt_translator.avalon_anti_slave_0
add_interface tx_iopll_waitrequest_pio_external_connection conduit end
set_interface_property tx_iopll_waitrequest_pio_external_connection EXPORT_OF tx_iopll_waitrequest_pio.external_connection
add_interface tx_os_pio_external_connection conduit end
set_interface_property tx_os_pio_external_connection EXPORT_OF tx_os_pio.external_connection
add_interface tx_pll_rcfg_mgmt_translator_avalon_anti_slave avalon master
set_interface_property tx_pll_rcfg_mgmt_translator_avalon_anti_slave EXPORT_OF tx_pll_rcfg_mgmt_translator.avalon_anti_slave_0
add_interface tx_pll_waitrequest_pio_external_connection conduit end
set_interface_property tx_pll_waitrequest_pio_external_connection EXPORT_OF tx_pll_waitrequest_pio.external_connection
add_interface tx_pma_cal_busy_pio_external_connection conduit end
set_interface_property tx_pma_cal_busy_pio_external_connection EXPORT_OF tx_pma_cal_busy_pio.external_connection
add_interface tx_pma_ch conduit end
set_interface_property tx_pma_ch EXPORT_OF tx_pma_ch.external_connection
add_interface tx_pma_rcfg_mgmt_translator_avalon_anti_slave avalon master
set_interface_property tx_pma_rcfg_mgmt_translator_avalon_anti_slave EXPORT_OF tx_pma_rcfg_mgmt_translator.avalon_anti_slave_0
add_interface tx_pma_waitrequest_pio_external_connection conduit end
set_interface_property tx_pma_waitrequest_pio_external_connection EXPORT_OF tx_pma_waitrequest_pio.external_connection
add_interface tx_rcfg_en_pio_external_connection conduit end
set_interface_property tx_rcfg_en_pio_external_connection EXPORT_OF tx_rcfg_en_pio.external_connection
add_interface tx_rst_pll_pio_external_connection conduit end
set_interface_property tx_rst_pll_pio_external_connection EXPORT_OF tx_rst_pll_pio.external_connection
add_interface tx_rst_xcvr_pio_external_connection conduit end
set_interface_property tx_rst_xcvr_pio_external_connection EXPORT_OF tx_rst_xcvr_pio.external_connection
add_interface wd_timer_resetrequest reset source
set_interface_property wd_timer_resetrequest EXPORT_OF wd_timer.resetrequest

set_interconnect_requirement {$system} qsys_mm.clockCrossingAdapter AUTO
set_interconnect_requirement {$system} qsys_mm.enableEccProtection FALSE
set_interconnect_requirement {$system} qsys_mm.insertDefaultSlave false
set_interconnect_requirement {$system} qsys_mm.maxAdditionalLatency 1

save_system nios.qsys
